# EAGLE design gatedriver_trafo_sma_compact_ACDC_3PS (EAGLE 7.2.0)
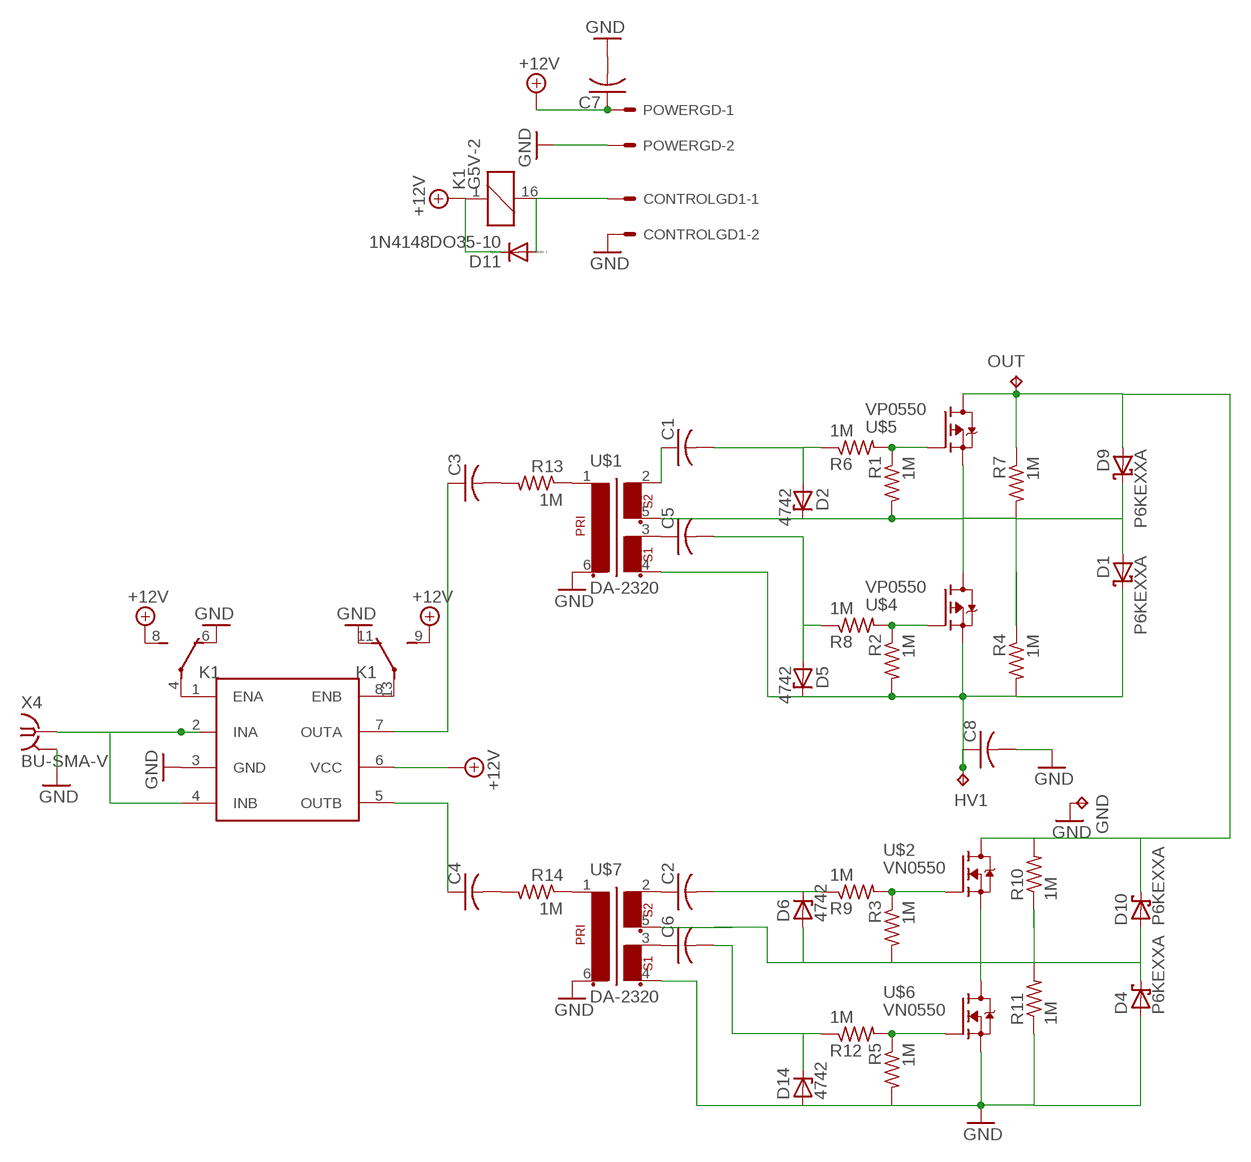
[diagram p0: schematic, sheet 1]

## Parts
C1  C-US050-055X075  [C050-055X075]
C2  C-US050-055X075  [C050-055X075]
C3  C-US050-055X075  [C050-055X075]
C4  C-US050-055X075  [C050-055X075]
C5  C-US050-055X075  [C050-055X075]
C6  C-US050-055X075  [C050-055X075]
C7  C-US050-030X075  [C050-030X075]
C8  C-US102-064X133  [C102-064X133]
CONTROLGD1  KK-156-2  [KK-156-2]
D1  P6KEXXA  [C1702-15]
D2  4742  ZENER-DIODEZD-10  [ZDIO-10]
D4  P6KEXXA  [C1702-15]
D5  4742  ZENER-DIODEZD-10  [ZDIO-10]
D6  4742  ZENER-DIODEZD-10  [ZDIO-10]
D9  P6KEXXA  [C1702-15]
D10  P6KEXXA  [C1702-15]
D11  1N4148DO35-10  [DO35-10]
D14  4742  ZENER-DIODEZD-10  [ZDIO-10]
GND  TPPAD1-20Y  [P1-20Y]
HV1  TPPAD1-20Y  [P1-20Y]
K1  G5V-2  [G5V-2]
OUT  TPPAD1-20Y  [P1-20Y]
POWERGD  KK-156-2  [KK-156-2]
R1  1M  R-US_0207/10  [0207/10]
R2  1M  R-US_0207/10  [0207/10]
R3  1M  R-US_0207/10  [0207/10]
R4  1M  R-US_0207/10  [0207/10]
R5  1M  R-US_0207/10  [0207/10]
R6  1M  R-US_0207/10  [0207/10]
R7  1M  R-US_0207/10  [0207/10]
R8  1M  R-US_0207/10  [0207/10]
R9  1M  R-US_0207/10  [0207/10]
R10  1M  R-US_0207/10  [0207/10]
R11  1M  R-US_0207/10  [0207/10]
R12  1M  R-US_0207/10  [0207/10]
R13  1M  R-US_0207/12  [0207/12]
R14  1M  R-US_0207/12  [0207/12]
U$1  DA-2320  [DIL06]
U$2  VN0550  [TO92-]
U$3  UCC27425  [DIL08]
U$4  VP0550  [TO92-]
U$5  VP0550  [TO92-]
U$6  VN0550  [TO92-]
U$7  DA-2320  [DIL06]
X4  BU-SMA-V  [BU-SMA-V]

## Nets
+15V: C7.1 D11.C K1.1 K1.8(1:S) K1.9(2:S) POWERGD.1 U$3.6(VCC) ; supply symbol labelled +12V
ENSW: CONTROLGD1.1 D11.A K1.16
GND: C7.2 C8.2 CONTROLGD1.2 D4.A D14.A GND.TP K1.6(1:O) K1.11(2:O) POWERGD.2 R11.1 U$1.6 U$3.3(GND) U$6.3(S) U$7.4 U$7.6 X4.2 X4.3 X4.4 X4.5
N$1: U$3.2(INA) U$3.4(INB) X4.1
N$2: C3.1 U$3.7(OUTA)
N$3: R13.1 U$1.1
N$4: C4.1 U$3.5(OUTB)
N$5: C1.1 U$1.2
N$6: R14.1 U$7.1
N$7: C5.1 U$1.3
N$8: R1.1 R6.2 U$5.2(G)
N$9: U$7.5
N$10: C1.2 D2.A R6.1
N$11: R5.1 R12.2 U$6.2(G)
N$12: R2.1 R8.2 U$4.2(G)
N$13: D4.C D6.A D10.A R10.1 R11.2 U$2.3(S) U$6.1(D)
N$14: K1.4(1:P) U$3.1(ENA)
N$15: K1.13(2:P) U$3.8(ENB)
N$16: C5.2 D5.A R8.1
N$17: C8.1 D1.C D5.C HV1.TP R2.2 R4.2 U$1.4 U$4.3(S)
N$18: D1.A D2.C D9.C R1.2 R4.1 R7.2 U$1.5 U$4.1(D) U$5.3(S)
N$19: C3.2 R13.2
N$20: C4.2 R14.2
N$21: D9.A D10.C OUT.TP R7.1 R10.2 U$2.1(D) U$5.1(D)
N$22: C2.1 U$7.2
N$23: C6.1 U$7.3
N$25: C2.2 D6.C R3.1 R9.1 R9.2 U$2.2(G)
N$27: C6.2 D14.C R12.1
Unconnected: R3.2 R5.2

## Library data of the parts
C1-C6 C8 = resistor:C-US: CAPACITOR, American symbol
C7 = rcl:C-US: CAPACITOR, American symbol
CONTROLGD1 POWERGD = con-molex:KK-156-2: KK 156 HEADER Source: http://www.molex.com/pdm_docs/sd/026604100_sd.pdf; OC_FARNELL: unknown; OC_NEWARK: unknown
D1 D4 D9 D10 = diode:P6KEXXA: DIODE transient-voltage suppressor
D2 D5 D6 D14 = diode:ZENER-DIODE: Z-Diode
D11 = diode:1N4148: DIODE high speed (Philips)
GND HV1 OUT = testpad:TP: Test pad
K1 = relay:G5V-2: OMRON PCB Relay Source: http://www.omron.com/ecb/products/pdf/en-g5v2.pdf; MPN: G5V-2 5DC; OC_FARNELL: 9949488; OC_NEWARK: 78K5703
R1-R14 = rcl:R-US_: RESISTOR, American symbol
U$1 U$7 = trafo:DA-2320
U$2 U$6 = transistor-fet:VN0550
U$3 = texas:UCC27425
U$4 U$5 = transistor-fet:VP0550
X4 = con-coax:BU-SMA-V: FEMALE SMA CONNECTOR Radiall distributor RS 112-3794; OC_FARNELL: unknown; OC_NEWARK: unknown

## Board
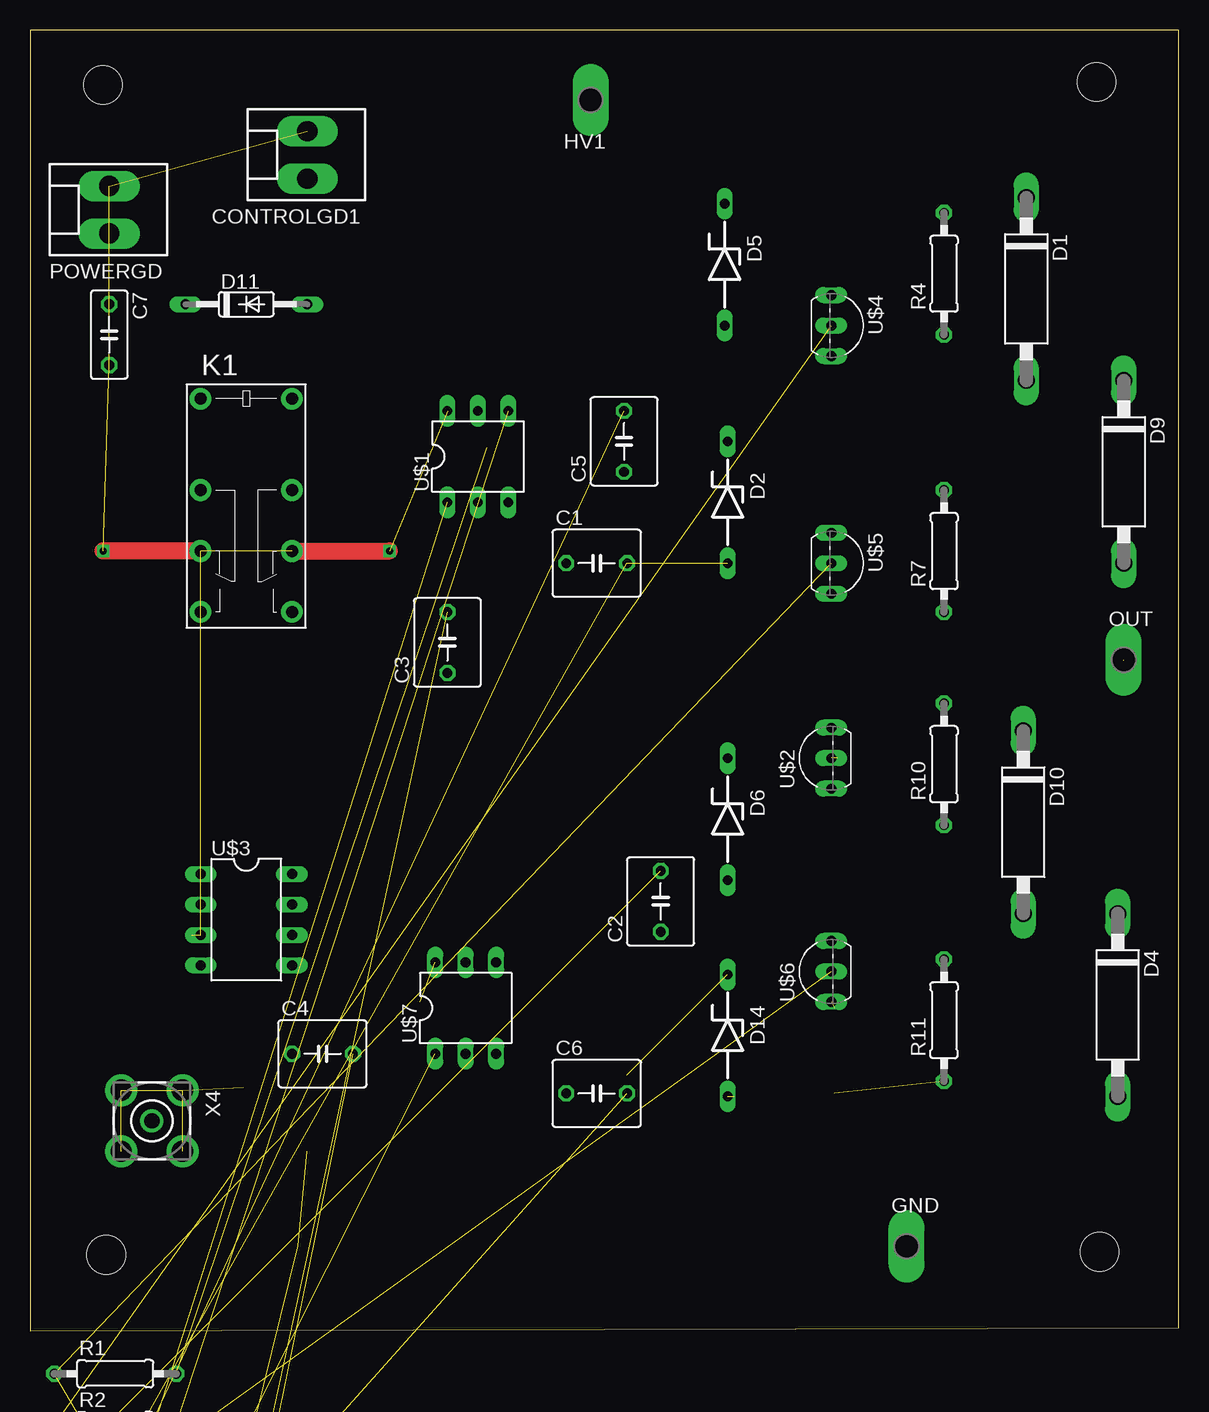
[diagram p1: board, top side]
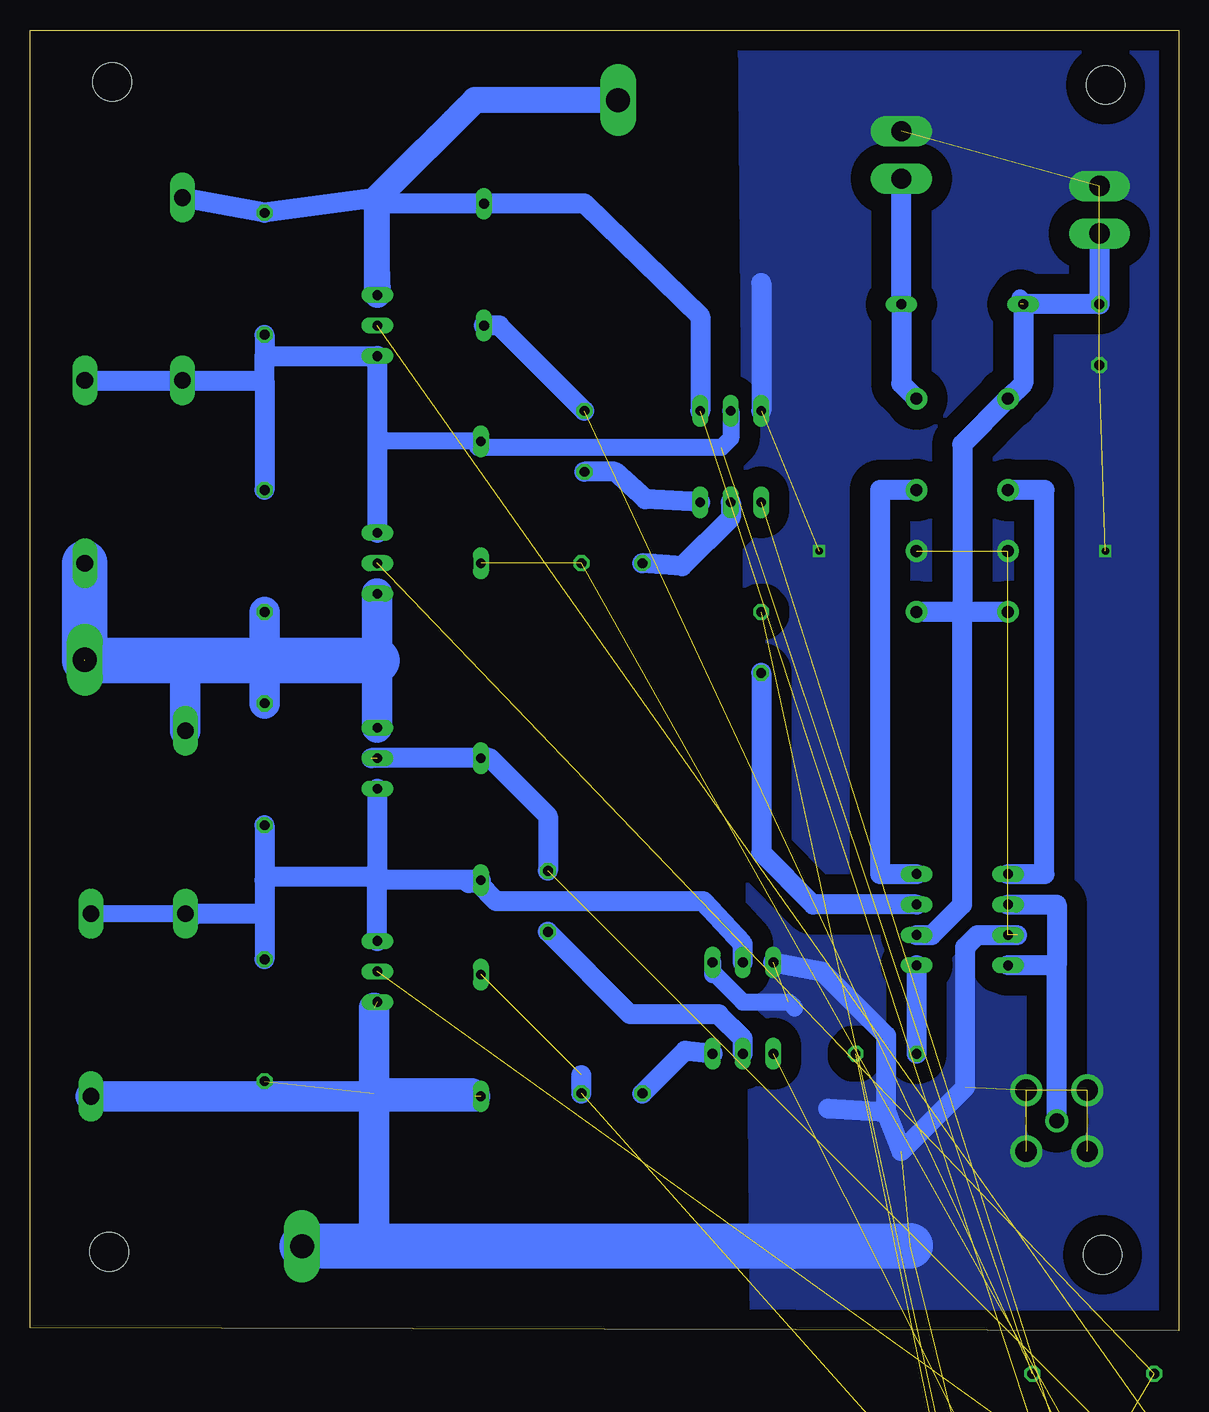
[diagram p2: board, bottom side, seen from below]

Size 95.76 x 108.46 mm. Coordinates in mm from the lower left corner, seen from the top.
Outline: 0,0 95.76,0.25 95.76,108.46 0,108.46 0,0
Copper layers (1*16): Top 0.035mm / dielectric 1.5mm / Bottom 0.035mm
Design rules "default": minimum track width 10mil, minimum drill 24mil, track to track 8mil, track to pad 8mil, pad to pad 8mil, via to via 8mil, smd to smd 8mil, copper to edge 40mil, drill to drill 8mil, minimum pad ring 10mil, minimum via ring 8mil, stop-mask expansion 4mil, vias tented up to drill 0mil, thermal gap 10mil
Holes 3.2 mm at 88.9,104.14 89.15,6.6 6.35,6.35 6.1,103.89

### Footprints (pad centres in the part's own frame; a part is rotated, then mirrored left to right if it is on the bottom)
C050-055X075 = drill 0.813 octagon: 1 -2.54,0; 2 2.54,0
C050-030X075 = drill 0.813 octagon: 1 -2.54,0; 2 2.54,0
C102-064X133 = drill 1.016 octagon: 1 -5.08,0; 2 5.08,0
KK-156-2 = drill 1.7 pad 2.184 long: 1 -1.98,0; 2 1.98,0
C1702-15 = drill 1.397 long: A 7.62,0; C -7.62,0
ZDIO-10 = drill 0.813 long: A 5.08,0; C -5.08,0
DO35-10 = drill 0.813 long: A 5.08,0; C -5.08,0
P1-20Y = drill 2.007 pad 2.54 long: TP 0,0
G5V-2 = drill 1 pad 1.8: 1 -8.89,-3.81; 4 -1.27,-3.81; 6 3.81,-3.81; 8 8.89,-3.81; 9 8.89,3.81; 11 3.81,3.81; 13 -1.27,3.81; 16 -8.89,3.81
0207/10 = drill 0.813 octagon: 1 -5.08,0; 2 5.08,0
0207/12 = drill 0.813 octagon: 1 -6.35,0; 2 6.35,0
DIL06 = drill 0.813 long: 1 -2.54,-3.81; 2 0,-3.81; 3 2.54,-3.81; 4 2.54,3.81; 5 0,3.81; 6 -2.54,3.81
TO92- = drill 0.813 long: 1 2.54,0; 2 0,0; 3 -2.54,0
DIL08 = drill 0.813 long: 1 -3.81,-3.81; 2 -1.27,-3.81; 3 1.27,-3.81; 4 3.81,-3.81; 5 3.81,3.81; 6 1.27,3.81; 7 -1.27,3.81; 8 -3.81,3.81
BU-SMA-V = drill 1.27: 1 0,0 | drill 1.778: 2 -2.55,2.55; 3 2.55,2.55; 4 2.55,-2.55; 5 -2.55,-2.55

### Placement (x,y rotation side)
C1  47.24,64.01 0 top
C2  52.58,35.81 90 top
C3  34.8,57.4 90 top
C4  24.38,23.11 0 top
C5  49.53,74.17 90 top
C6  47.24,19.81 0 top
C7  6.6,83.06 270 top
C8  3.56,-48.51 0 top  (outside the outline)
CONTROLGD1  23.11,98.04 90 top
D1  83.06,86.87 270 top
D2  58.17,69.09 270 top
D4  90.68,27.18 270 top
D5  57.91,88.9 270 top
D6  58.17,42.67 270 top
D9  91.19,71.63 270 top
D10  82.8,42.42 270 top
D11  18.03,85.6 0 top
D14  58.17,24.64 270 top
GND  73.08,7.06 0 top
HV1  46.74,102.62 180 top
K1  18.03,68.83 270 top
OUT  91.19,55.96 0 top
POWERGD  6.6,93.47 90 top
R1  7.11,-3.56 0 top  (outside the outline)
R2  7.11,-7.87 0 top  (outside the outline)
R3  7.11,-12.19 0 top  (outside the outline)
R4  76.2,88.14 90 top
R5  7.11,-16.51 0 top  (outside the outline)
R6  7.11,-20.83 0 top  (outside the outline)
R7  76.2,65.02 90 top
R8  7.11,-25.15 0 top  (outside the outline)
R9  7.11,-29.46 0 top  (outside the outline)
R10  76.2,47.24 90 top
R11  76.2,25.91 90 top
R12  7.11,-33.78 0 top  (outside the outline)
R13  7.11,-38.1 0 top  (outside the outline)
R14  7.11,-42.42 0 top  (outside the outline)
U$1  37.34,72.9 0 top
U$2  66.8,47.75 90 top
U$3  18.03,34.29 270 top
U$4  66.8,83.82 270 top
U$5  66.8,64.01 270 top
U$6  66.8,29.97 90 top
U$7  36.32,26.92 0 top
X4  10.16,17.53 270 top

### Tracks (layer width: path | path; a pad name or v marks a point on that pad's centre or on a via)
+15V  (1 unrouted)
  Bottom 1.422: 13.21,85.6 13.21,86.11
  Bottom 1.676: D11.C 12.95,78.99 K1.1 18.03,73.91 18.03,59.94 | 18.03,59.94 18.03,35.56 20.57,33.02 U$3.6 | 18.03,59.94 K1.9 | K1.8 18.03,59.94 | POWERGD.1 C7.1 13.21,85.6
ENSW
  Bottom 1.676: CONTROLGD1.1 D11.A 23.11,78.99 K1.16
GND  (via drill 0.6)  (17 unrouted)
  Top 1.422: K1.11 v29.97,65.02 | K1.6 v6.1,65.02
  Bottom 1.422: U$7.4 38.86,29.72 38.61,29.72 36.32,27.43 32.51,27.43 32,26.92
  Bottom 1.676: 34.8,87.38 U$1.6 | U$7.6 29.72,29.97 24.38,24.64 24.38,18.29 | 29.21,18.54 24.38,18.29 | 24.38,18.29 23.11,14.99 17.78,20.32 17.78,32 16.76,33.02 13.46,33.02
  Bottom 2.54: D4.A 58.67,19.56 58.93,19.81 67.06,19.81 67.06,26.92 67.06,7.09
  Bottom 3.81: GND.TP 67.06,7.09 32.21,7.06 22.35,7.11
  pour Bottom (isolate 1.676, no thermals): -0.25,108.46 36.58,108.46 35.56,0.25 0,-0.25
N$1
  Bottom 1.676: X4.1 10.16,30.48 | U$3.2 10.16,35.56 10.16,30.48 | 10.16,30.48 U$3.4
N$2
  Bottom 1.676: U$3.7 30.48,35.56 34.8,39.88 C3.1
N$3  (1 unrouted)
N$4
  Bottom 1.676: U$3.5 C4.1
N$5
  Bottom 1.676: U$1.2 37.34,67.82 41.4,63.75 C1.1
N$6  (1 unrouted)
N$7
  Bottom 1.676: U$1.3 44.45,69.34 46.99,71.63 C5.1
N$8  (2 unrouted)
N$9
  Bottom 1.676: U$7.5 36.32,32.26 39.62,35.81 56.9,35.81 58.42,37.34 59.18,37.34
N$10  (2 unrouted)
N$11  (2 unrouted)
N$12  (2 unrouted)
N$13
  Bottom 1.422: D4.C D10.A 82.3,34.8 82.3,34.29
  Bottom 1.676: U$2.3 66.8,37.59 | R10.1 76.2,37.59 | 76.2,37.59 76.2,34.8 | 76.2,34.8 R11.2 | D10.A 76.2,34.8 | D6.A 66.8,37.59 | U$6.1 66.8,37.59 | 66.8,37.59 66.55,37.85 75.95,37.85 76.2,37.59
N$14
  Bottom 1.676: 13.72,38.1 U$3.1 11.18,38.1 11.18,70.1 K1.4
N$15
  Bottom 1.676: K1.13 24.89,70.1 24.89,38.1 U$3.8
N$16  (1 unrouted)
  Bottom 1.676: C5.2 56.64,83.82 D5.A
N$17  (2 unrouted)
  Bottom 1.676: 66.8,94.49 66.55,86.61 U$4.3 | 66.8,94.49 66.82,94.23 66.56,93.98 D5.C 49.53,93.98 39.88,84.58 U$1.4 | 66.8,94.49 R4.2 D1.C
  Bottom 2.184: U$4.3 66.82,94.23 | HV1.TP 58.67,102.62 66.8,94.49
N$18  (1 unrouted)
  Bottom 1.422: U$1.5 37.34,74.42 38.1,73.66 58.42,73.66 D2.C 66.55,74.17 66.8,73.91
  Bottom 1.676: U$5.3 66.8,73.91 U$4.1 76.2,81.28 | D9.C D1.A 76.2,79.25 | 76.2,79.25 76.2,81.28 | 76.2,79.25 R7.2 | R4.1 76.2,81.28
N$19  (1 unrouted)
N$20  (1 unrouted)
N$21  (1 unrouted)
  Bottom 2.54: U$5.1 66.8,55.88 U$2.1 | R10.2 76.2,55.88 R7.1 | D10.C 82.8,55.88
  Bottom 3.81: D9.A 91.19,55.88 82.8,55.88 76.2,55.88 66.8,55.88
N$22
  Bottom 1.676: U$7.2 36.32,24.38 38.35,26.42 45.72,26.42 C2.1
N$23
  Bottom 1.676: U$7.3 41.15,23.37 C6.1
N$25  (4 unrouted)
  Bottom 1.676: C2.2 52.58,42.93 57.4,47.75 D6.C 67.31,47.75
N$27  (2 unrouted)
  Bottom 1.676: C6.2 49.78,21.34